# EAGLE schematic touch_glove_bullshit (EAGLE 7.7.0)
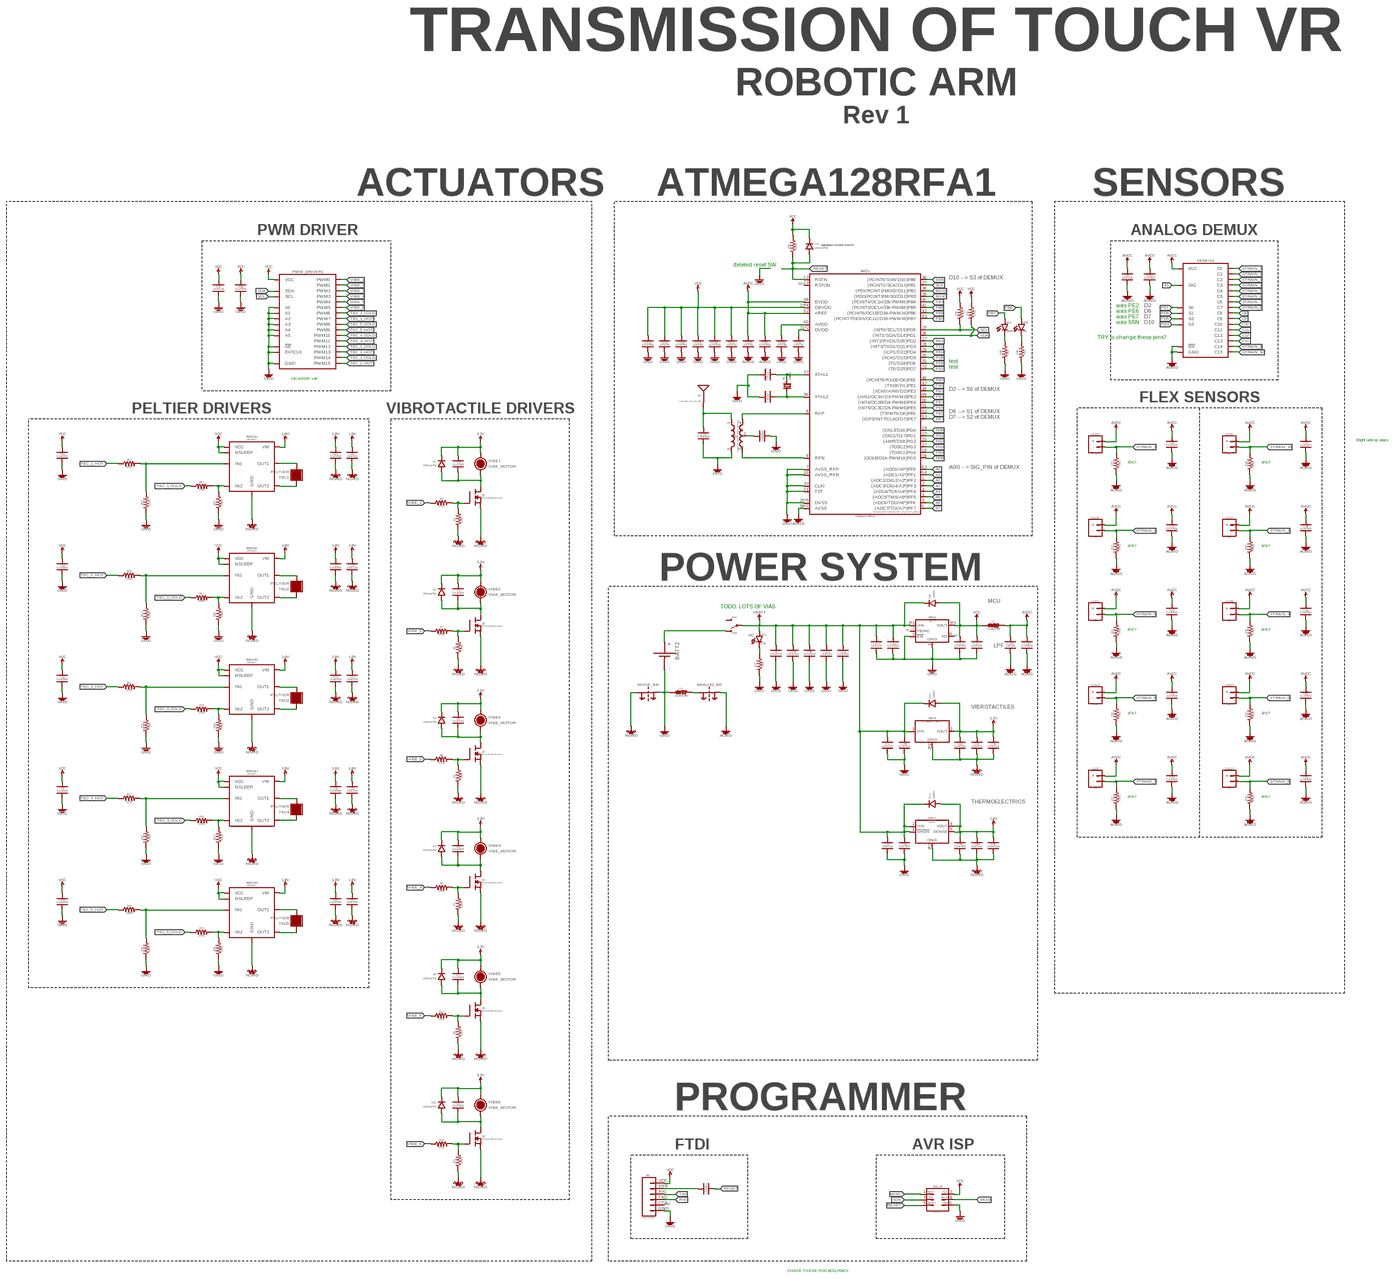
[diagram p0: schematic, sheet 1, overview]
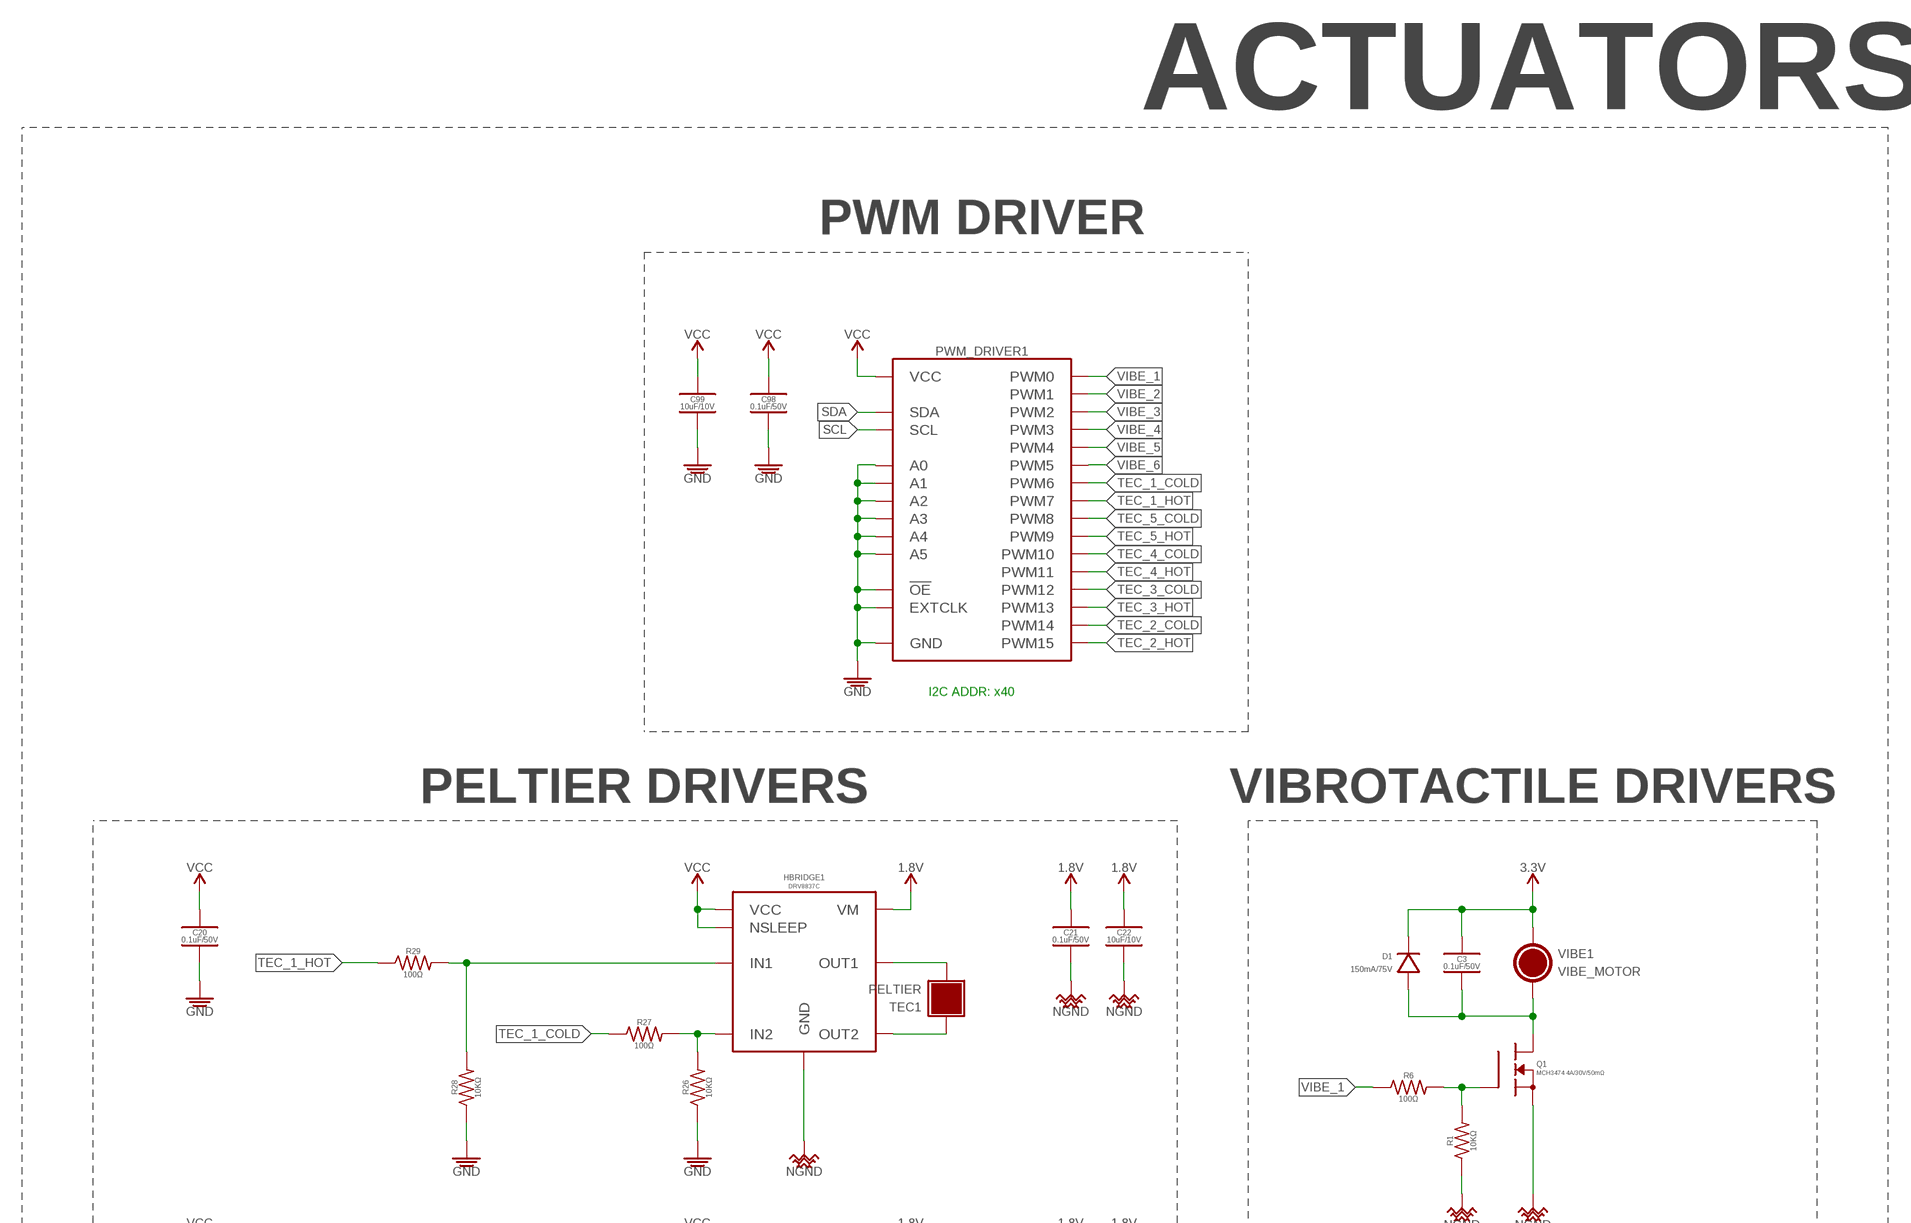
[diagram p1: schematic, sheet 1, part 1 of 4]
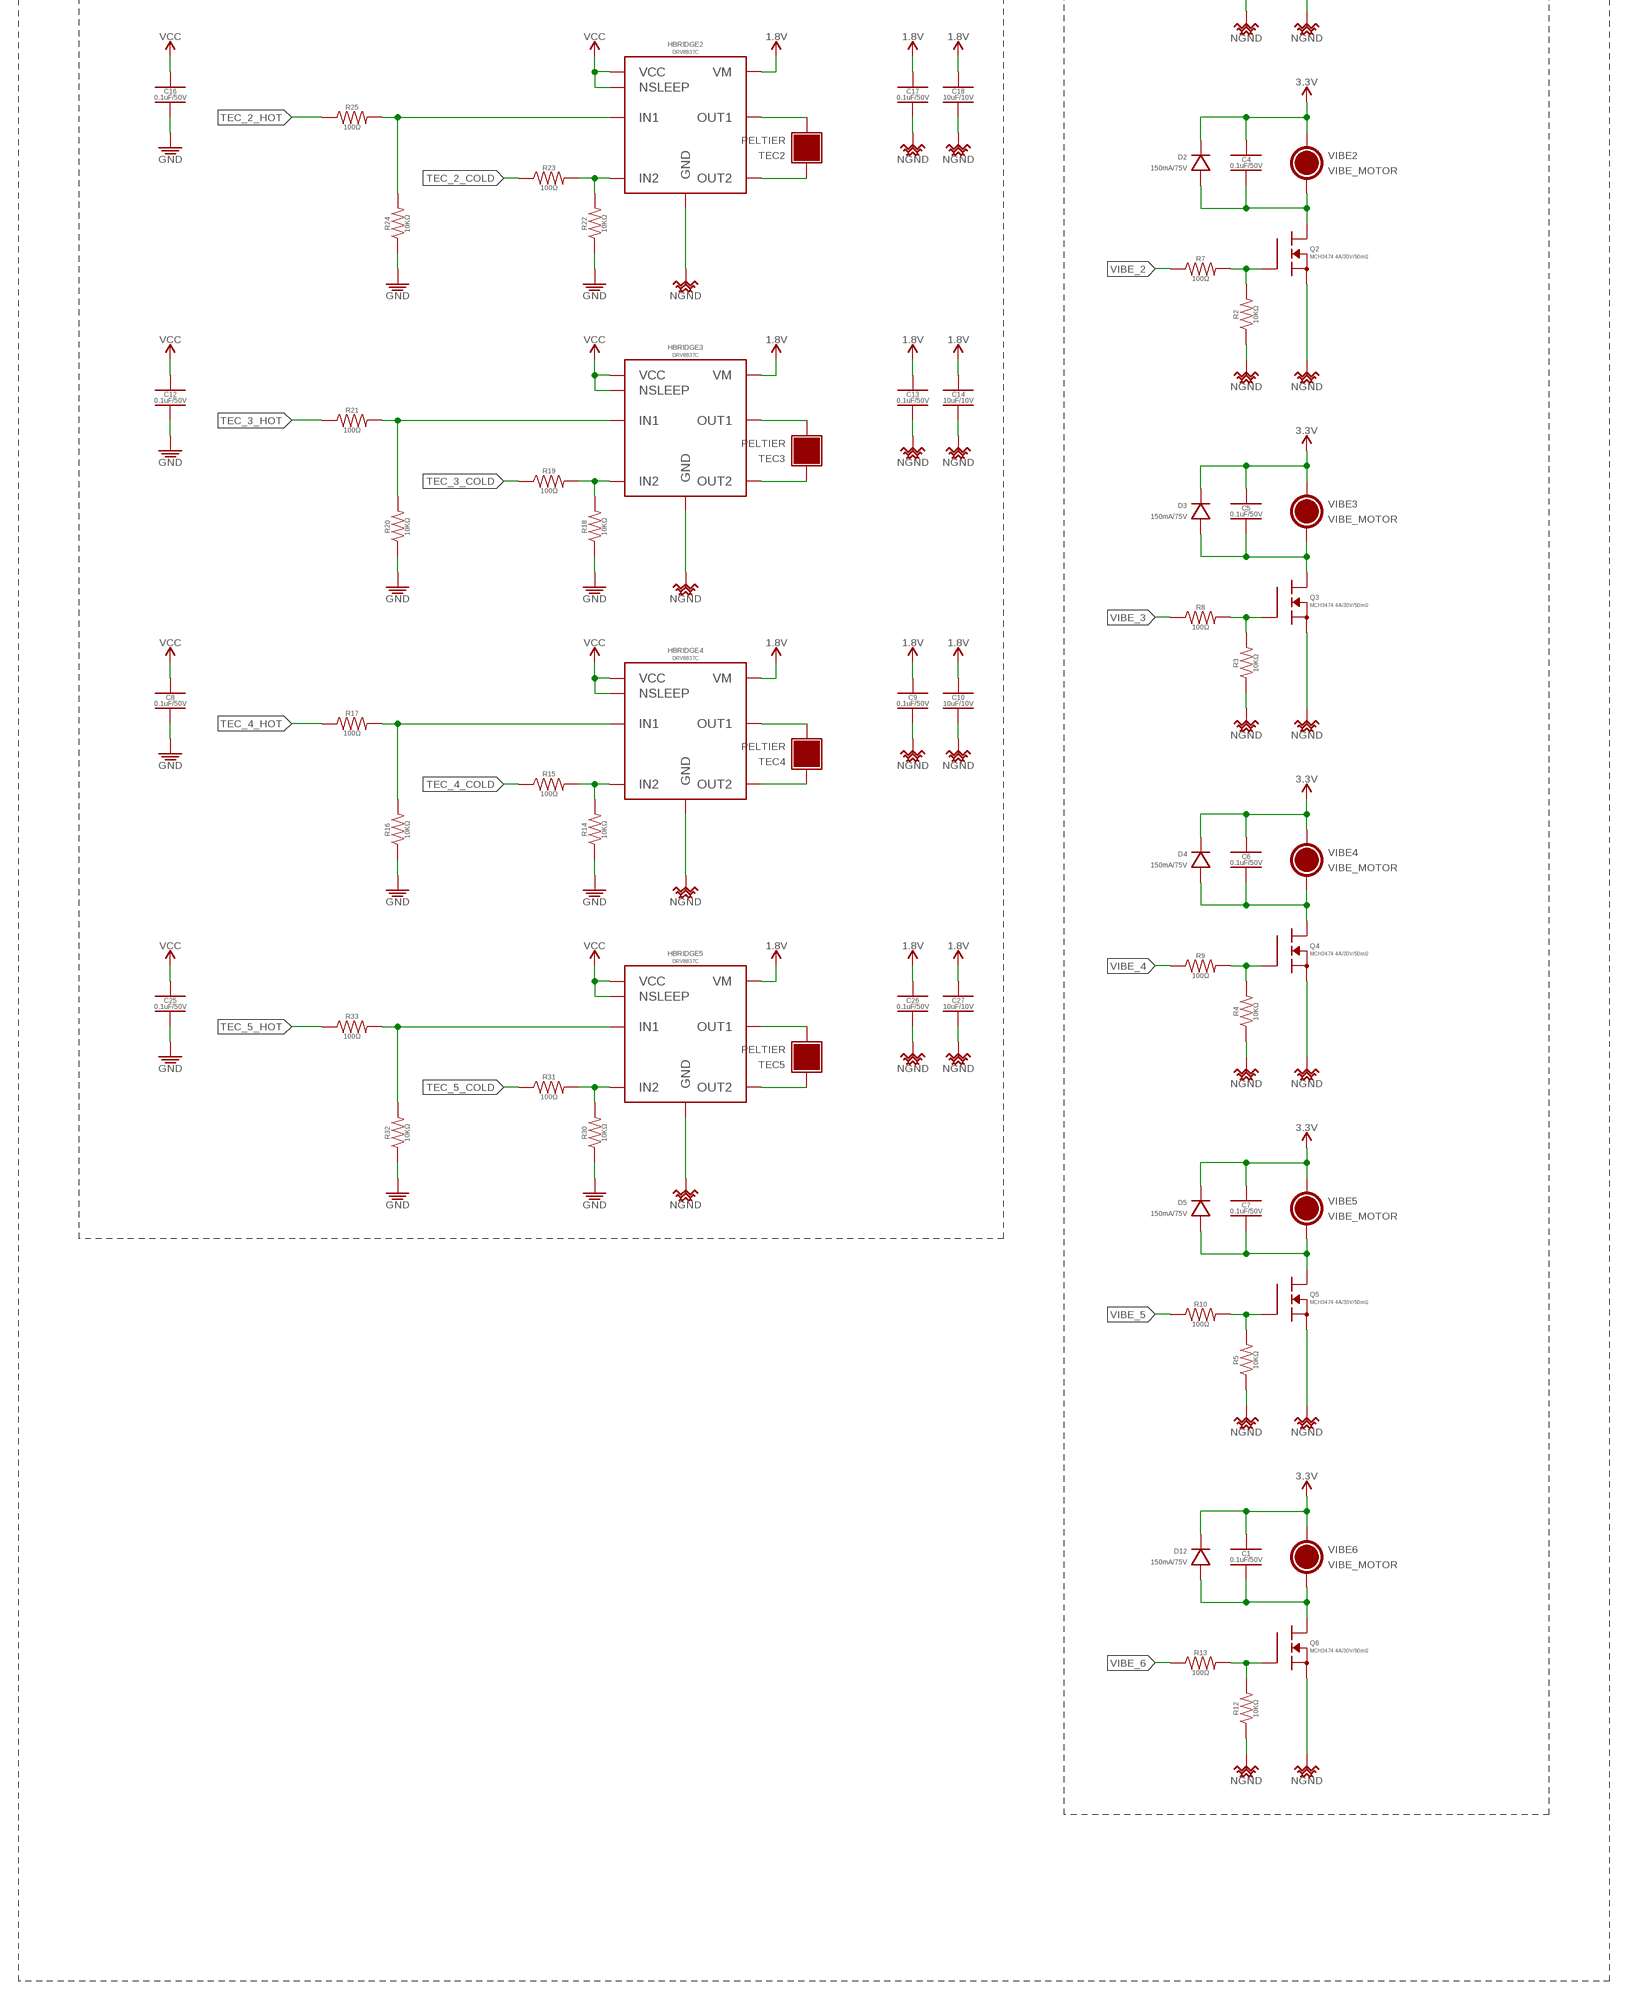
[diagram p2: schematic, sheet 1, part 2 of 4]
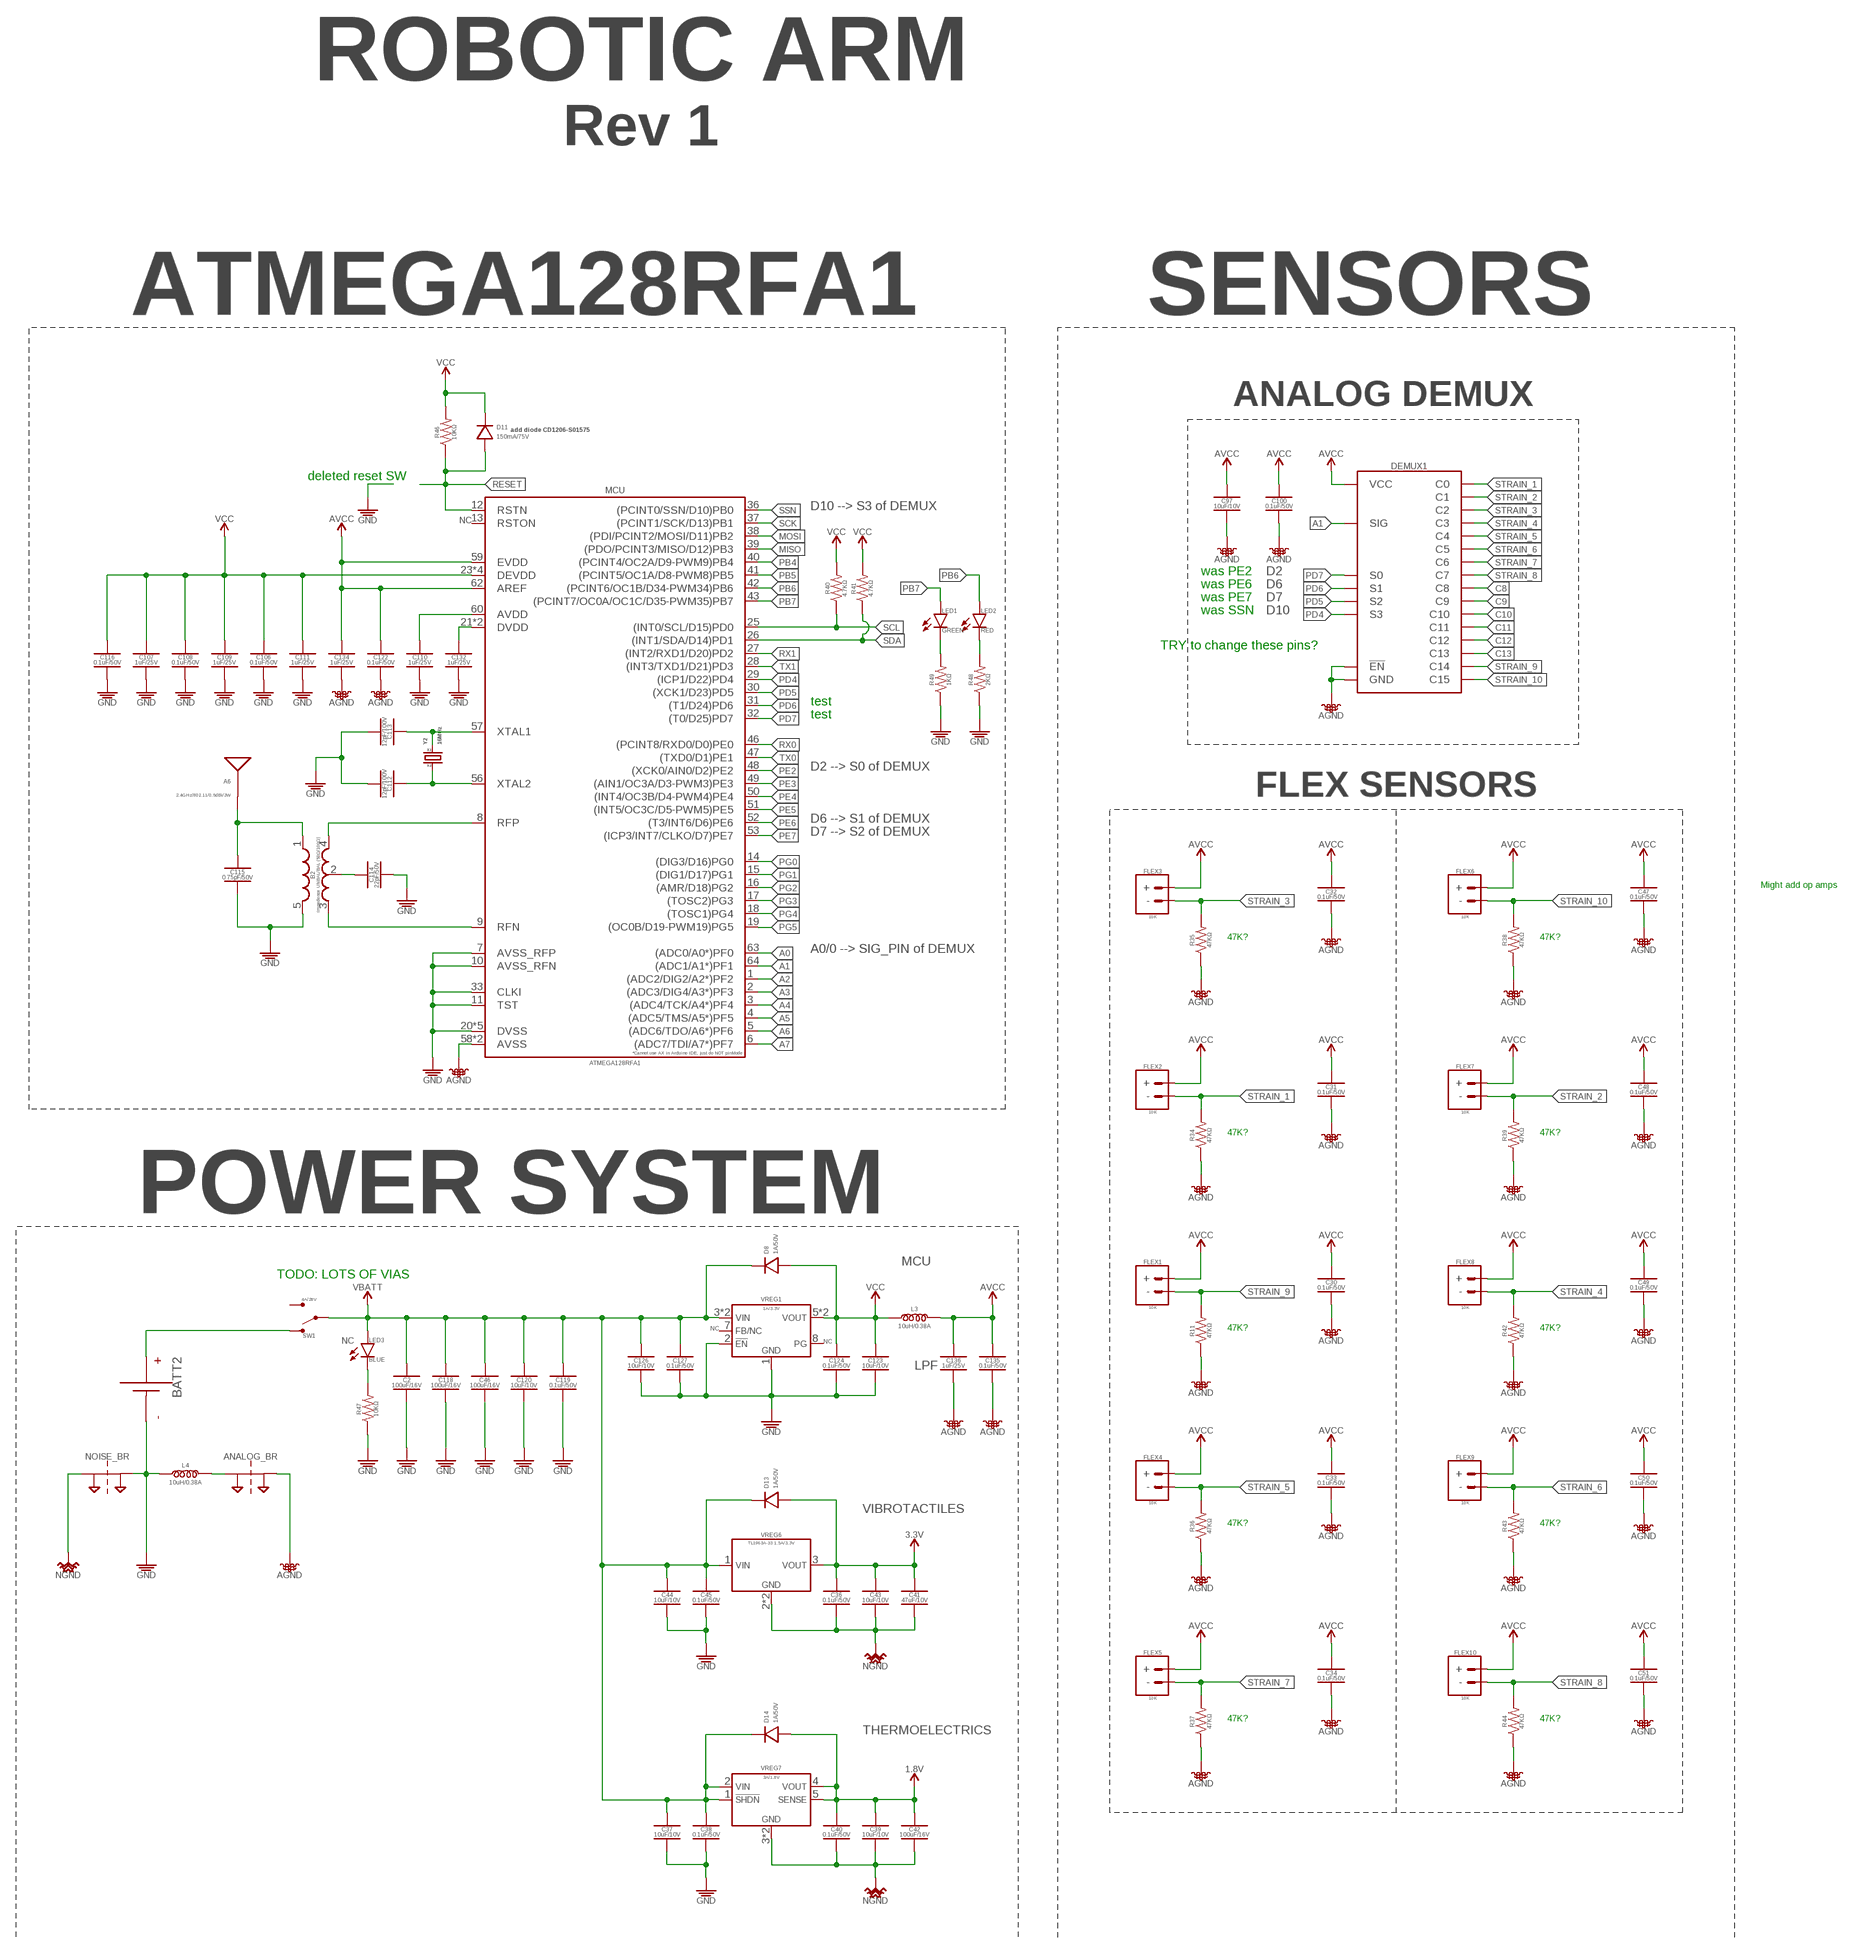
[diagram p3: schematic, sheet 1, part 3 of 4]
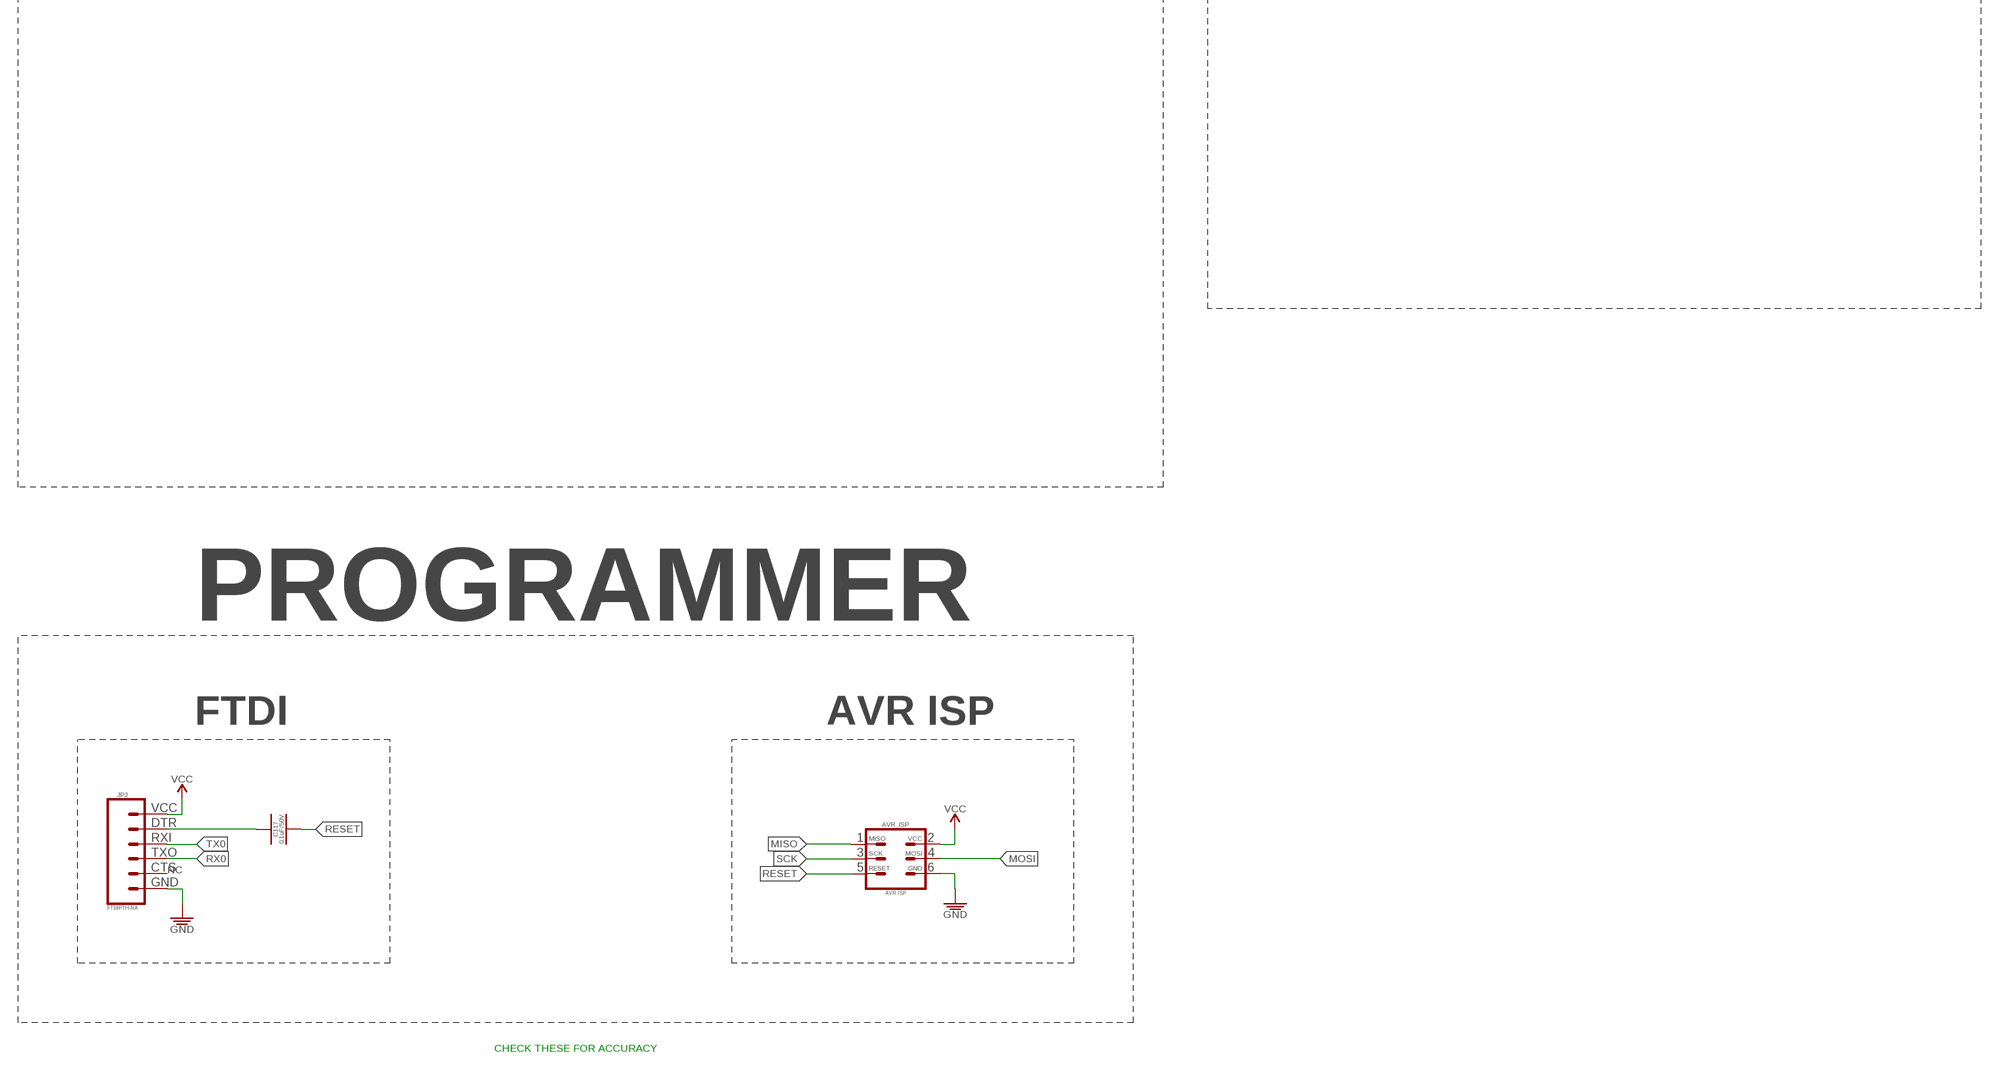
[diagram p4: schematic, sheet 1, part 4 of 4]

## Parts
A6  2.4GHz/802.11/0.5dBi/3W  ANTENNA_SMD-CHIP_2.4GHZ-0.5DBI-3W  [ANTENNA-CHIP5]
ANALOG_BR  2PT_GND_TIE  [2PT_GND_TIE]
AVR_ISP  AVR ISP  AVR_SPI_PRG_6NS  [2X3-NS]
B2  Impedence UNBAL/BAL (50Ω/100Ω)  BALUN_SMD-0805_UNBAL/BAL-50/100  [0805_BALUN]
BATT2  BATTERYPTH_HOLES  [DUAL_PTH_PADS]
C1  0.1uF/50V  0.1UF_SMD-0402_50V-10%  [_CER_SMD_0402]
C2  100uF/16V  100UF_CER_SMD-1210_16V-20%  [_CER_SMD-1210]
C3  0.1uF/50V  0.1UF_SMD-0402_50V-10%  [_CER_SMD_0402]
C4  0.1uF/50V  0.1UF_SMD-0402_50V-10%  [_CER_SMD_0402]
C5  0.1uF/50V  0.1UF_SMD-0402_50V-10%  [_CER_SMD_0402]
C6  0.1uF/50V  0.1UF_SMD-0402_50V-10%  [_CER_SMD_0402]
C7  0.1uF/50V  0.1UF_SMD-0402_50V-10%  [_CER_SMD_0402]
C8  0.1uF/50V  0.1UF_SMD-0402_50V-10%  [_CER_SMD_0402]
C9  0.1uF/50V  0.1UF_SMD-0402_50V-10%  [_CER_SMD_0402]
C10  10uF/10V  10UF_CER_SMD-0402_10V-20%  [_CER_SMD_0402]
C12  0.1uF/50V  0.1UF_SMD-0402_50V-10%  [_CER_SMD_0402]
C13  0.1uF/50V  0.1UF_SMD-0402_50V-10%  [_CER_SMD_0402]
C14  10uF/10V  10UF_CER_SMD-0402_10V-20%  [_CER_SMD_0402]
C16  0.1uF/50V  0.1UF_SMD-0402_50V-10%  [_CER_SMD_0402]
C17  0.1uF/50V  0.1UF_SMD-0402_50V-10%  [_CER_SMD_0402]
C18  10uF/10V  10UF_CER_SMD-0402_10V-20%  [_CER_SMD_0402]
C20  0.1uF/50V  0.1UF_SMD-0402_50V-10%  [_CER_SMD_0402]
C21  0.1uF/50V  0.1UF_SMD-0402_50V-10%  [_CER_SMD_0402]
C22  10uF/10V  10UF_CER_SMD-0402_10V-20%  [_CER_SMD_0402]
C25  0.1uF/50V  0.1UF_SMD-0402_50V-10%  [_CER_SMD_0402]
C26  0.1uF/50V  0.1UF_SMD-0402_50V-10%  [_CER_SMD_0402]
C27  10uF/10V  10UF_CER_SMD-0402_10V-20%  [_CER_SMD_0402]
C30  0.1uF/50V  0.1UF_SMD-0402_50V-10%  [_CER_SMD_0402]
C31  0.1uF/50V  0.1UF_SMD-0402_50V-10%  [_CER_SMD_0402]
C32  0.1uF/50V  0.1UF_SMD-0402_50V-10%  [_CER_SMD_0402]
C33  0.1uF/50V  0.1UF_SMD-0402_50V-10%  [_CER_SMD_0402]
C34  0.1uF/50V  0.1UF_SMD-0402_50V-10%  [_CER_SMD_0402]
C36  0.1uF/50V  0.1UF_SMD-0402_50V-10%  [_CER_SMD_0402]
C37  10uF/10V  10UF_CER_SMD-0402_10V-20%  [_CER_SMD_0402]
C38  0.1uF/50V  0.1UF_SMD-0402_50V-10%  [_CER_SMD_0402]
C39  10uF/10V  10UF_CER_SMD-0402_10V-20%  [_CER_SMD_0402]
C40  0.1uF/50V  0.1UF_SMD-0402_50V-10%  [_CER_SMD_0402]
C41  47uF/10V  47UF_CER_SMD-0805_10V-20%  [_CER_SMD-805]
C42  100uF/16V  100UF_CER_SMD-1210_16V-20%  [_CER_SMD-1210]
C43  10uF/10V  10UF_CER_SMD-0402_10V-20%  [_CER_SMD_0402]
C44  10uF/10V  10UF_CER_SMD-0402_10V-20%  [_CER_SMD_0402]
C45  0.1uF/50V  0.1UF_SMD-0402_50V-10%  [_CER_SMD_0402]
C46  100uF/16V  100UF_CER_SMD-1210_16V-20%  [_CER_SMD-1210]
C47  0.1uF/50V  0.1UF_SMD-0402_50V-10%  [_CER_SMD_0402]
C48  0.1uF/50V  0.1UF_SMD-0402_50V-10%  [_CER_SMD_0402]
C49  0.1uF/50V  0.1UF_SMD-0402_50V-10%  [_CER_SMD_0402]
C50  0.1uF/50V  0.1UF_SMD-0402_50V-10%  [_CER_SMD_0402]
C51  0.1uF/50V  0.1UF_SMD-0402_50V-10%  [_CER_SMD_0402]
C97  10uF/10V  10UF_CER_SMD-0402_10V-20%  [_CER_SMD_0402]
C98  0.1uF/50V  0.1UF_SMD-0402_50V-10%  [_CER_SMD_0402]
C99  10uF/10V  10UF_CER_SMD-0402_10V-20%  [_CER_SMD_0402]
C100  0.1uF/50V  0.1UF_SMD-0402_50V-10%  [_CER_SMD_0402]
C106  0.1uF/50V  0.1UF_SMD-0402_50V-10%  [_CER_SMD_0402]
C107  1uF/25V  1UF_CER_SMD-0402_25V-10%  [_CER_SMD_0402]
C108  0.1uF/50V  0.1UF_SMD-0402_50V-10%  [_CER_SMD_0402]
C109  1uF/25V  1UF_CER_SMD-0402_25V-10%  [_CER_SMD_0402]
C110  1uF/25V  1UF_CER_SMD-0402_25V-10%  [_CER_SMD_0402]
C111  1uF/25V  1UF_CER_SMD-0402_25V-10%  [_CER_SMD_0402]
C112  12pF/100V  12PF_SMD-0402_100V-5%  [_CER_SMD_0402]
C113  12pF/100V  12PF_SMD-0402_100V-5%  [_CER_SMD_0402]
C114  22pF/50V  22PF_SMD-0402_100V-5%  [_CER_SMD_0402]
C115  0.75pF/50V  0.75PF_SMD-0402_50V-33%  [_CER_SMD_0402]
C116  0.1uF/50V  0.1UF_SMD-0402_50V-10%  [_CER_SMD_0402]
C117  0.1uF/50V  0.1UF_SMD-0402_50V-10%  [_CER_SMD_0402]
C118  100uF/16V  100UF_CER_SMD-1210_16V-20%  [_CER_SMD-1210]
C119  0.1uF/50V  0.1UF_SMD-0402_50V-10%  [_CER_SMD_0402]
C120  10uF/10V  10UF_CER_SMD-0402_10V-20%  [_CER_SMD_0402]
C122  0.1uF/50V  0.1UF_SMD-0402_50V-10%  [_CER_SMD_0402]
C123  10uF/10V  10UF_CER_SMD-0402_10V-20%  [_CER_SMD_0402]
C124  0.1uF/50V  0.1UF_SMD-0402_50V-10%  [_CER_SMD_0402]
C126  10uF/10V  10UF_CER_SMD-0402_10V-20%  [_CER_SMD_0402]
C127  0.1uF/50V  0.1UF_SMD-0402_50V-10%  [_CER_SMD_0402]
C132  1uF/25V  1UF_CER_SMD-0402_25V-10%  [_CER_SMD_0402]
C134  1uF/25V  1UF_CER_SMD-0402_25V-10%  [_CER_SMD_0402]
C135  0.1uF/50V  0.1UF_SMD-0402_50V-10%  [_CER_SMD_0402]
C136  1uF/25V  1UF_CER_SMD-0402_25V-10%  [_CER_SMD_0402]
D1  150mA/75V  DIODE_GENERAL-PURPOSE_SMD-0402_GP_120MA-75V  [SOD-923F/0402]
D2  150mA/75V  DIODE_GENERAL-PURPOSE_SMD-0402_GP_120MA-75V  [SOD-923F/0402]
D3  150mA/75V  DIODE_GENERAL-PURPOSE_SMD-0402_GP_120MA-75V  [SOD-923F/0402]
D4  150mA/75V  DIODE_GENERAL-PURPOSE_SMD-0402_GP_120MA-75V  [SOD-923F/0402]
D5  150mA/75V  DIODE_GENERAL-PURPOSE_SMD-0402_GP_120MA-75V  [SOD-923F/0402]
D8  1A/50V  DIODE_GENERAL-PURPOSE_SMD_GP_1A-50V  [SOD123F]
D11  150mA/75V  DIODE_GENERAL-PURPOSE_SMD-0402_GP_120MA-75V  [SOD-923F/0402]
D12  150mA/75V  DIODE_GENERAL-PURPOSE_SMD-0402_GP_120MA-75V  [SOD-923F/0402]
D13  1A/50V  DIODE_GENERAL-PURPOSE_SMD_GP_1A-50V  [SOD123F]
D14  1A/50V  DIODE_GENERAL-PURPOSE_SMD_GP_1A-50V  [SOD123F]
DEMUX1  CH16_MUX-DEMUX  CD74HC4067-SM96_16:1_MUX-DEMUX  [SSOP-24]
FLEX1  10K  FLEX-SENSOR10K_2.2IN  [CONNECTOR_FSR]
FLEX2  10K  FLEX-SENSOR10K_2.2IN  [CONNECTOR_FSR]
FLEX3  10K  FLEX-SENSOR10K_2.2IN  [CONNECTOR_FSR]
FLEX4  10K  FLEX-SENSOR10K_2.2IN  [CONNECTOR_FSR]
FLEX5  10K  FLEX-SENSOR10K_2.2IN  [CONNECTOR_FSR]
FLEX6  10K  FLEX-SENSOR10K_2.2IN  [CONNECTOR_FSR]
FLEX7  10K  FLEX-SENSOR10K_2.2IN  [CONNECTOR_FSR]
FLEX8  10K  FLEX-SENSOR10K_2.2IN  [CONNECTOR_FSR]
FLEX9  10K  FLEX-SENSOR10K_2.2IN  [CONNECTOR_FSR]
FLEX10  10K  FLEX-SENSOR10K_2.2IN  [CONNECTOR_FSR]
HBRIDGE1  DRV8837C  DRV883X_H-BRIDGE_DRV8837C_1A  [WSON-8-PPAD]
HBRIDGE2  DRV8837C  DRV883X_H-BRIDGE_DRV8837C_1A  [WSON-8-PPAD]
HBRIDGE3  DRV8837C  DRV883X_H-BRIDGE_DRV8837C_1A  [WSON-8-PPAD]
HBRIDGE4  DRV8837C  DRV883X_H-BRIDGE_DRV8837C_1A  [WSON-8-PPAD]
HBRIDGE5  DRV8837C  DRV883X_H-BRIDGE_DRV8837C_1A  [WSON-8-PPAD]
JP2  FTDIPTH-RA  [FTDI_BASIC-6PIN-MALE-RA]
L3  10uH/0.38A  10UH_SMD-0603_0.38A-0.468OHM-10%  [_SMD-0603]
L4  10uH/0.38A  10UH_SMD-0603_0.38A-0.468OHM-10%  [_SMD-0603]
LED1  GREEN  LED_SMD-0402_DISCRETE_GREEN  [LED_SMD-0402]
LED2  RED  LED_SMD-0402_DISCRETE_RED  [LED_SMD-0402]
LED3  BLUE  LED_SMD-0402_DISCRETE_BLUE  [LED_SMD-0402]
MCU  ATMEGA128RFA1  ATMEGA128RFA1_VFQFN-64_EXPOSED-PAD  [VFQFN-64]
NOISE_BR  2PT_GND_TIE  [2PT_GND_TIE]
PWM_DRIVER1  PCA9685  PCA9685_16-CH_12-BIT_PWM-DRIVER  [TSSOP-28]
Q1  MCH3474 4A/30V/50mΩ  POWER_NCHAN_MCH3474  [SC-70FL/MCPH3]
Q2  MCH3474 4A/30V/50mΩ  POWER_NCHAN_MCH3474  [SC-70FL/MCPH3]
Q3  MCH3474 4A/30V/50mΩ  POWER_NCHAN_MCH3474  [SC-70FL/MCPH3]
Q4  MCH3474 4A/30V/50mΩ  POWER_NCHAN_MCH3474  [SC-70FL/MCPH3]
Q5  MCH3474 4A/30V/50mΩ  POWER_NCHAN_MCH3474  [SC-70FL/MCPH3]
Q6  MCH3474 4A/30V/50mΩ  POWER_NCHAN_MCH3474  [SC-70FL/MCPH3]
R1  10KΩ  10KΩ_SMD-0402_1/16W-5%  [RESISTOR_SMD-0402]
R2  10KΩ  10KΩ_SMD-0402_1/16W-5%  [RESISTOR_SMD-0402]
R3  10KΩ  10KΩ_SMD-0402_1/16W-5%  [RESISTOR_SMD-0402]
R4  10KΩ  10KΩ_SMD-0402_1/16W-5%  [RESISTOR_SMD-0402]
R5  10KΩ  10KΩ_SMD-0402_1/16W-5%  [RESISTOR_SMD-0402]
R6  100Ω  100Ω_SMD-0402_1/16W-5%  [RESISTOR_SMD-0402]
R7  100Ω  100Ω_SMD-0402_1/16W-5%  [RESISTOR_SMD-0402]
R8  100Ω  100Ω_SMD-0402_1/16W-5%  [RESISTOR_SMD-0402]
R9  100Ω  100Ω_SMD-0402_1/16W-5%  [RESISTOR_SMD-0402]
R10  100Ω  100Ω_SMD-0402_1/16W-5%  [RESISTOR_SMD-0402]
R11  47KΩ  47KΩ_SMD-0402_1/16W-5%  [RESISTOR_SMD-0402]
R12  10KΩ  10KΩ_SMD-0402_1/16W-5%  [RESISTOR_SMD-0402]
R13  100Ω  100Ω_SMD-0402_1/16W-5%  [RESISTOR_SMD-0402]
R14  10KΩ  10KΩ_SMD-0402_1/16W-5%  [RESISTOR_SMD-0402]
R15  100Ω  100Ω_SMD-0402_1/16W-5%  [RESISTOR_SMD-0402]
R16  10KΩ  10KΩ_SMD-0402_1/16W-5%  [RESISTOR_SMD-0402]
R17  100Ω  100Ω_SMD-0402_1/16W-5%  [RESISTOR_SMD-0402]
R18  10KΩ  10KΩ_SMD-0402_1/16W-5%  [RESISTOR_SMD-0402]
R19  100Ω  100Ω_SMD-0402_1/16W-5%  [RESISTOR_SMD-0402]
R20  10KΩ  10KΩ_SMD-0402_1/16W-5%  [RESISTOR_SMD-0402]
R21  100Ω  100Ω_SMD-0402_1/16W-5%  [RESISTOR_SMD-0402]
R22  10KΩ  10KΩ_SMD-0402_1/16W-5%  [RESISTOR_SMD-0402]
R23  100Ω  100Ω_SMD-0402_1/16W-5%  [RESISTOR_SMD-0402]
R24  10KΩ  10KΩ_SMD-0402_1/16W-5%  [RESISTOR_SMD-0402]
R25  100Ω  100Ω_SMD-0402_1/16W-5%  [RESISTOR_SMD-0402]
R26  10KΩ  10KΩ_SMD-0402_1/16W-5%  [RESISTOR_SMD-0402]
R27  100Ω  100Ω_SMD-0402_1/16W-5%  [RESISTOR_SMD-0402]
R28  10KΩ  10KΩ_SMD-0402_1/16W-5%  [RESISTOR_SMD-0402]
R29  100Ω  100Ω_SMD-0402_1/16W-5%  [RESISTOR_SMD-0402]
R30  10KΩ  10KΩ_SMD-0402_1/16W-5%  [RESISTOR_SMD-0402]
R31  100Ω  100Ω_SMD-0402_1/16W-5%  [RESISTOR_SMD-0402]
R32  10KΩ  10KΩ_SMD-0402_1/16W-5%  [RESISTOR_SMD-0402]
R33  100Ω  100Ω_SMD-0402_1/16W-5%  [RESISTOR_SMD-0402]
R34  47KΩ  47KΩ_SMD-0402_1/16W-5%  [RESISTOR_SMD-0402]
R35  47KΩ  47KΩ_SMD-0402_1/16W-5%  [RESISTOR_SMD-0402]
R36  47KΩ  47KΩ_SMD-0402_1/16W-5%  [RESISTOR_SMD-0402]
R37  47KΩ  47KΩ_SMD-0402_1/16W-5%  [RESISTOR_SMD-0402]
R38  47KΩ  47KΩ_SMD-0402_1/16W-5%  [RESISTOR_SMD-0402]
R39  47KΩ  47KΩ_SMD-0402_1/16W-5%  [RESISTOR_SMD-0402]
R40  4.7KΩ  4.7KΩ_SMD-0402_1/16W-5%  [RESISTOR_SMD-0402]
R41  4.7KΩ  4.7KΩ_SMD-0402_1/16W-5%  [RESISTOR_SMD-0402]
R42  47KΩ  47KΩ_SMD-0402_1/16W-5%  [RESISTOR_SMD-0402]
R43  47KΩ  47KΩ_SMD-0402_1/16W-5%  [RESISTOR_SMD-0402]
R44  47KΩ  47KΩ_SMD-0402_1/16W-5%  [RESISTOR_SMD-0402]
R46  10KΩ  10KΩ_SMD-0402_1/16W-5%  [RESISTOR_SMD-0402]
R47  10KΩ  10KΩ_SMD-0402_1/16W-5%  [RESISTOR_SMD-0402]
R48  2KΩ  2KΩ_SMD-0402_1/16W-5%  [RESISTOR_SMD-0402]
R49  1KΩ  1KΩ_SMD-0402_1/16W-5%  [RESISTOR_SMD-0402]
SW1  4A/28V  SWITCH_SPDT_RA_PTH_4A-28V_L12.7-W9.5  [SW_SLIDE_RA_SPDT_4A-28V_L12.7-W9.5]
TEC1  PELTIER  PELTIER-TECNL1025T_1.8A-4.4V_L10.7-W8.8-H2  [CONNECTOR_PELTIER]
TEC2  PELTIER  PELTIER-TECNL1025T_1.8A-4.4V_L10.7-W8.8-H2  [CONNECTOR_PELTIER]
TEC3  PELTIER  PELTIER-TECNL1025T_1.8A-4.4V_L10.7-W8.8-H2  [CONNECTOR_PELTIER]
TEC4  PELTIER  PELTIER-TECNL1025T_1.8A-4.4V_L10.7-W8.8-H2  [CONNECTOR_PELTIER]
TEC5  PELTIER  PELTIER-TECNL1025T_1.8A-4.4V_L10.7-W8.8-H2  [CONNECTOR_PELTIER]
VIBE1  VIBE_MOTOR  VIBE_MOTOR_100MA/3V  [CONNECTOR_VIBE-MOTOR]
VIBE2  VIBE_MOTOR  VIBE_MOTOR_100MA/3V  [CONNECTOR_VIBE-MOTOR]
VIBE3  VIBE_MOTOR  VIBE_MOTOR_100MA/3V  [CONNECTOR_VIBE-MOTOR]
VIBE4  VIBE_MOTOR  VIBE_MOTOR_100MA/3V  [CONNECTOR_VIBE-MOTOR]
VIBE5  VIBE_MOTOR  VIBE_MOTOR_100MA/3V  [CONNECTOR_VIBE-MOTOR]
VIBE6  VIBE_MOTOR  VIBE_MOTOR_100MA/3V  [CONNECTOR_VIBE-MOTOR]
VREG1  1A/3.3V  VREG_TPS76833_ULDO_FAST-TRANSIENT_1A-3.3VTPS76833QDR_1A-3.3V  [SOIC-8_W3.9MM]
VREG6  TL1963A-33 1.5A/3.3V  VREG_LINEAR_FIXED_TL1963A-33_LDO_1.5A-3.3V  [SOT223-4]
VREG7  3A/1.8V  VREG_LT1764EQ_ULDO_FAST-TRANSIENT_LT1764EQ-1.8_3A-1.8V  [DDPAK-5]
Y2  16MHz  CRYSTAL_ABM3B_16MHZ_18PF  [CRYSTAL-SMD-5X3]

## Nets
1.8V: C9.1 C10.1 C13.1 C14.1 C17.1 C18.1 C21.1 C22.1 C26.1 C27.1 C39.1 C40.1 C42.1 D14.A HBRIDGE1.1(VM) HBRIDGE2.1(VM) HBRIDGE3.1(VM) HBRIDGE4.1(VM) HBRIDGE5.1(VM) VREG7.4(VOUT) VREG7.5(SENSE)
3.3V: C1.1 C3.1 C4.1 C5.1 C6.1 C7.1 C36.1 C41.1 C43.1 D1.K D2.K D3.K D4.K D5.K D12.K D13.A VIBE1.1(+) VIBE2.1(+) VIBE3.1(+) VIBE4.1(+) VIBE5.1(+) VIBE6.1(+) VREG6.3(VO)
A0: MCU.63((ADC0/A0*)PF0)
A1: DEMUX1.1(SIG) MCU.64((ADC1/A1*)PF1)
A2: MCU.1((ADC2/DIG2/A2*)PF2)
A3: MCU.2((ADC3/DIG4/A3*)PF3)
A4: MCU.3((ADC4/TCK/A4*)PF4)
A5: MCU.4((ADC5/TMS/A5*)PF5)
A6: MCU.5((ADC6/TDO/A6*)PF6)
A7: MCU.6((ADC7/TDI/A7*)PF7)
AGND: ANALOG_BR.P$2 C30.2 C31.2 C32.2 C33.2 C34.2 C47.2 C48.2 C49.2 C50.2 C51.2 C97.2 C100.2 C122.2 C134.2 C135.2 C136.2 DEMUX1.12(GND) DEMUX1.15(!EN) MCU.58(AVSS) MCU.61(AVSS) R11.1 R34.1 R35.1 R36.1 R37.1 R38.1 R39.1 R42.1 R43.1 R44.1
AVCC: C30.1 C31.1 C32.1 C33.1 C34.1 C47.1 C48.1 C49.1 C50.1 C51.1 C97.1 C100.1 C122.1 C134.1 C135.1 C136.1 DEMUX1.24(VCC) FLEX1.+ FLEX2.+ FLEX3.+ FLEX4.+ FLEX5.+ FLEX6.+ FLEX7.+ FLEX8.+ FLEX9.+ FLEX10.+ L3.2 MCU.59(EVDD) MCU.62(AREF)
BATT_+: BATT2.+(P) SW1.P
C8: DEMUX1.23(C8)
C9: DEMUX1.22(C9)
C10: DEMUX1.21(C10)
C11: DEMUX1.20(C11)
C12: DEMUX1.19(C12)
C13: DEMUX1.18(C13)
GND: AVR_ISP.6 B2.5(GND) BATT2.-(N) C2.2 C8.2 C12.2 C16.2 C20.2 C25.2 C37.2 C38.2 C44.2 C45.2 C46.2 C98.2 C99.2 C106.2 C107.2 C108.2 C109.2 C110.2 C111.2 C112.2 C113.2 C114.2 C115.2 C116.2 C118.2 C119.2 C120.2 C123.2 C124.2 C126.2 C127.2 C132.2 JP2.GND L4.1 MCU.7(AVSS_RFP) MCU.10(AVSS_RFN) MCU.11(TST) MCU.20(DVSS) MCU.24(DVSS) MCU.33(CLKI) MCU.35(DVSS) MCU.45(DVSS) MCU.55(DVSS) NOISE_BR.P$2 PWM_DRIVER1.1(A0) PWM_DRIVER1.2(A1) PWM_DRIVER1.3(A2) PWM_DRIVER1.4(A3) PWM_DRIVER1.5(A4) PWM_DRIVER1.14(GND) PWM_DRIVER1.23(!OE) PWM_DRIVER1.24(A5) PWM_DRIVER1.25(EXTCLK) R14.1 R16.1 R18.1 R20.1 R22.1 R24.1 R26.1 R28.1 R30.1 R32.1 R47.1 R48.1 R49.1 VREG1.1(GND) VREG1.2(!EN)
MISO: AVR_ISP.1 MCU.39((PDO/PCINT3/MISO/D12)PB3)
MOSI: AVR_ISP.4 MCU.38((PDI/PCINT2/MOSI/D11)PB2)
N$1: HBRIDGE5.3(OUT2) TEC5.HOT
N$2: C6.2 D4.A Q4.3(D) VIBE4.2(-)
N$3: C7.2 D5.A Q5.3(D) VIBE5.2(-)
N$4: C5.2 D3.A Q3.3(D) VIBE3.2(-)
N$5: HBRIDGE5.2(OUT1) TEC5.COLD
N$6: HBRIDGE4.2(OUT1) TEC4.COLD
N$7: Q2.1(G) R2.2 R7.2
N$8: HBRIDGE4.5(IN2) R14.2 R15.2
N$9: Q3.1(G) R3.2 R8.2
N$10: HBRIDGE4.6(IN1) R16.2 R17.2
N$11: HBRIDGE4.3(OUT2) TEC4.HOT
N$12: HBRIDGE3.3(OUT2) TEC3.HOT
N$13: HBRIDGE3.5(IN2) R18.2 R19.2
N$14: HBRIDGE3.6(IN1) R20.2 R21.2
N$15: C4.2 D2.A Q2.3(D) VIBE2.2(-)
N$16: HBRIDGE3.2(OUT1) TEC3.COLD
N$17: C3.2 D1.A Q1.3(D) VIBE1.2(-)
N$18: HBRIDGE2.3(OUT2) TEC2.HOT
N$19: HBRIDGE2.5(IN2) R22.2 R23.2
N$20: HBRIDGE2.6(IN1) R24.2 R25.2
N$21: Q4.1(G) R4.2 R9.2
N$22: Q5.1(G) R5.2 R10.2
N$23: HBRIDGE2.2(OUT1) TEC2.COLD
N$24: HBRIDGE1.3(OUT2) TEC1.HOT
N$25: HBRIDGE1.5(IN2) R26.2 R27.2
N$26: HBRIDGE1.6(IN1) R28.2 R29.2
N$27: HBRIDGE1.2(OUT1) TEC1.COLD
N$28: Q1.1(G) R1.2 R6.2
N$29: HBRIDGE5.5(IN2) R30.2 R31.2
N$30: C1.2 D12.A Q6.3(D) VIBE6.2(-)
N$31: HBRIDGE5.6(IN1) R32.2 R33.2
N$32: Q6.1(G) R12.2 R13.2
N$44: C113.1 MCU.57(XTAL1) Y2.3
N$45: B2.3(OUT2) MCU.9(RFN)
N$46: B2.4(OUT1) MCU.8(RFP)
N$47: B2.2(GND) C114.1
N$48: C112.1 MCU.56(XTAL2) Y2.1
N$49: A6.FEED(SIGNAL) B2.1(IN) C115.1
N$50: C117.1 JP2.DTR
N$52: ANALOG_BR.P$1 L4.2
N$53: LED3.K R47.2
N$54: LED1.K R49.2
N$55: LED2.K R48.2
N$62: C132.1 MCU.21(DVDD) MCU.22(DVDD)
N$63: C110.1 MCU.60(AVDD)
NGND: C9.2 C10.2 C13.2 C14.2 C17.2 C18.2 C21.2 C22.2 C26.2 C27.2 C36.2 C39.2 C40.2 C41.2 C42.2 C43.2 HBRIDGE1.4(GND) HBRIDGE1.GND HBRIDGE1.P$1(GND) HBRIDGE1.P$2(GND) HBRIDGE2.4(GND) HBRIDGE2.GND HBRIDGE2.P$1(GND) HBRIDGE2.P$2(GND) HBRIDGE3.4(GND) HBRIDGE3.GND HBRIDGE3.P$1(GND) HBRIDGE3.P$2(GND) HBRIDGE4.4(GND) HBRIDGE4.GND HBRIDGE4.P$1(GND) HBRIDGE4.P$2(GND) HBRIDGE5.4(GND) HBRIDGE5.GND HBRIDGE5.P$1(GND) HBRIDGE5.P$2(GND) NOISE_BR.P$1 Q1.2(S) Q2.2(S) Q3.2(S) Q4.2(S) Q5.2(S) Q6.2(S) R1.1 R2.1 R3.1 R4.1 R5.1 R12.1 VREG6.2(GND) VREG6.TAB(GND) VREG7.3(GND) VREG7.TAB(GND)
PB4: MCU.40((PCINT4/OC2A/D9-PWM9)PB4)
PB5: MCU.41((PCINT5/OC1A/D8-PWM8)PB5)
PB6: LED2.A MCU.42((PCINT6/OC1B/D34-PWM34)PB6)
PB7: LED1.A MCU.43((PCINT7/OC0A/OC1C/D35-PWM35)PB7)
PD4: DEMUX1.13(S3) MCU.29((ICP1/D22)PD4)
PD5: DEMUX1.14(S2) MCU.30((XCK1/D23)PD5)
PD6: DEMUX1.11(S1) MCU.31((T1/D24)PD6)
PD7: DEMUX1.10(S0) MCU.32((T0/D25)PD7)
PE2: MCU.48((XCK0/AIN0/D2)PE2)
PE3: MCU.49((AIN1/OC3A/D3-PWM3)PE3)
PE4: MCU.50((INT4/OC3B/D4-PWM4)PE4)
PE5: MCU.51((INT5/OC3C/D5-PWM5)PE5)
PE6: MCU.52((T3/INT6/D6)PE6)
PE7: MCU.53((ICP3/INT7/CLKO/D7)PE7)
PG0: MCU.14((DIG3/D16)PG0)
PG1: MCU.15((DIG1/D17)PG1)
PG2: MCU.16((AMR/D18)PG2)
PG3: MCU.17((TOSC2)PG3)
PG4: MCU.18((TOSC1)PG4)
PG5: MCU.19((OC0B/D19-PWM19)PG5)
RESET: AVR_ISP.5 C117.2 D11.A MCU.12(RSTN) R46.1
RX0: JP2.TXO MCU.46((PCINT8/RXD0/D0)PE0)
RX1: MCU.27((INT2/RXD1/D20)PD2)
SCK: AVR_ISP.3 MCU.37((PCINT1/SCK/D13)PB1)
SCL: MCU.25((INT0/SCL/D15)PD0) PWM_DRIVER1.26(SCL) R40.1
SDA: MCU.26((INT1/SDA/D14)PD1) PWM_DRIVER1.27(SDA) R41.1
SSN: MCU.36((PCINT0/SSN/D10)PB0)
STRAIN_1: DEMUX1.9(C0) FLEX2.- R34.2
STRAIN_2: DEMUX1.8(C1) FLEX7.- R39.2
STRAIN_3: DEMUX1.7(C2) FLEX3.- R35.2
STRAIN_4: DEMUX1.6(C3) FLEX8.- R42.2
STRAIN_5: DEMUX1.5(C4) FLEX4.- R36.2
STRAIN_6: DEMUX1.4(C5) FLEX9.- R43.2
STRAIN_7: DEMUX1.3(C6) FLEX5.- R37.2
STRAIN_8: DEMUX1.2(C7) FLEX10.- R44.2
STRAIN_9: DEMUX1.17(C14) FLEX1.- R11.2
STRAIN_10: DEMUX1.16(C15) FLEX6.- R38.2
TEC_1_COLD: PWM_DRIVER1.12(PWM6) R27.1
TEC_1_HOT: PWM_DRIVER1.13(PWM7) R29.1
TEC_2_COLD: PWM_DRIVER1.21(PWM14) R23.1
TEC_2_HOT: PWM_DRIVER1.22(PWM15) R25.1
TEC_3_COLD: PWM_DRIVER1.19(PWM12) R19.1
TEC_3_HOT: PWM_DRIVER1.20(PWM13) R21.1
TEC_4_COLD: PWM_DRIVER1.17(PWM10) R15.1
TEC_4_HOT: PWM_DRIVER1.18(PWM11) R17.1
TEC_5_COLD: PWM_DRIVER1.15(PWM8) R31.1
TEC_5_HOT: PWM_DRIVER1.16(PWM9) R33.1
TX0: JP2.RXI MCU.47((TXD0/D1)PE1)
TX1: MCU.28((INT3/TXD1/D21)PD3)
VBATT: C2.1 C37.1 C38.1 C44.1 C45.1 C46.1 C118.1 C119.1 C120.1 C126.1 C127.1 D8.K D13.K D14.K LED3.A SW1.S1 VREG1.3(VIN) VREG1.4(VIN) VREG6.1(VI) VREG7.1(!SHDN) VREG7.2(VIN)
VCC: AVR_ISP.2 C8.1 C12.1 C16.1 C20.1 C25.1 C98.1 C99.1 C106.1 C107.1 C108.1 C109.1 C111.1 C116.1 C123.1 C124.1 D8.A D11.K HBRIDGE1.7(NSLEEP) HBRIDGE1.8(VCC) HBRIDGE2.7(NSLEEP) HBRIDGE2.8(VCC) HBRIDGE3.7(NSLEEP) HBRIDGE3.8(VCC) HBRIDGE4.7(NSLEEP) HBRIDGE4.8(VCC) HBRIDGE5.7(NSLEEP) HBRIDGE5.8(VCC) JP2.VCC L3.1 MCU.23(DEVDD) MCU.34(DEVDD) MCU.44(DEVDD) MCU.54(DEVDD) PWM_DRIVER1.28(VCC) R40.2 R41.2 R46.2 VREG1.5(VOUT) VREG1.6(VOUT)
VIBE_1: PWM_DRIVER1.6(PWM0) R6.1
VIBE_2: PWM_DRIVER1.7(PWM1) R7.1
VIBE_3: PWM_DRIVER1.8(PWM2) R8.1
VIBE_4: PWM_DRIVER1.9(PWM3) R9.1
VIBE_5: PWM_DRIVER1.10(PWM4) R10.1
VIBE_6: PWM_DRIVER1.11(PWM5) R13.1
Unconnected: JP2.CTS MCU.13(RSTON) SW1.S2 VREG1.7(FB/NC) VREG1.8(PG)

## Notes on the sheet
- TRANSMISSION OF TOUCH VR
- ROBOTIC ARM
- Rev 1
- ACTUATORS | ATMEGA128RFA1 | SENSORS
- PWM DRIVER | ANALOG DEMUX
- add diode CD1206-S01575
- deleted reset SW
- D10 --> S3 of DEMUX
- NC
- was PE2 | D2
- was PE6 | D6
- was PE7 | D7
- was SSN | D10
- TRY to change these pins?
- test
- test
- I2C ADDR: x40
- D2 --> S0 of DEMUX
- FLEX SENSORS
- PELTIER DRIVERS | VIBROTACTILE DRIVERS
- D6 --> S1 of DEMUX
- D7 --> S2 of DEMUX
- Might add op amps
- 47K? | 47K?
- A0/0 --> SIG_PIN of DEMUX
- 47K? | 47K?
- POWER SYSTEM
- MCU
- TODO: LOTS OF VIAS
- NC | 47K? | 47K?
- NC | NC
- LPF
- VIBROTACTILES
- 47K? | 47K?
- 47K? | 47K?
- THERMOELECTRICS
- PROGRAMMER
- FTDI | AVR ISP
- NC
- CHECK THESE FOR ACCURACY

## Library data of the parts
A6 = PiB_radio_frequency:ANTENNA: Chip antenna Single endded antenna. Common with smaller chip antennas. CHIP4 package is the GPS Chip Antenna SKU: GPS-08418. CHIP5 package is 2.4GHz chip antenna SKU: WRL-00144.; CREATOR: Kenmei; DATASHEET: http://www.linxtechnologies.com/resources/data-guides/ant-xxx-chp-x.pdf; DIST: Digikey; DISTLINK: https://www.digikey.com/products/en?keywords=ANT-2.45-CHPCT-ND; DISTPN: ANT-2.45-CHPCT-ND; MFR: Linx Technologies Inc.; MPN: ANT-2.45-CHP-T
ANALOG_BR NOISE_BR = PiB_power_symbols:2PT_GND_TIE
AVR_ISP = PiB_connectors:AVR_SPI_PRG_6: AVR ISP 6 Pin This is the reduced ISP connector for AVR programming. Common on Arduino. This footprint will take up less PCB space and can be used with a 10-pin to 6-pin adapter such as SKU: BOB-08508; DATASHEET: http://portal.fciconnect.com/Comergent//fci/drawing/67996.pdf; DIST: Digikey; DISTLINK: https://www.digikey.com/products/en?keywords=609-3234-ND; DISTPN: 609-3234-ND; MFR: Amphenol FCI; MPN: 67997-206HLF
B2 = PiB_radio_frequency:BALUN: 0805 footprint balun- Ember 351/357; CREATOR: Kenmei; DATASHEET: http://katalog.we-online.de/pbs/datasheet/748421245.pdf; DIST: Digikey; DISTLINK: https://www.digikey.com/products/en?keywords=732-2230-6-ND; DISTPN: 732-2230-6-ND; MFR: Wurth Electronics Inc; MPN: 748421245
BATT2 = PiB:BATTERY: Generic Dual SMD Pad for Bettery Soldering
C1 C3-C9 C12 C13 C16 C17 C20 C21 C25 C26 C30-C34 C36 C38 C40 C45 C47-C51 C98 C100 C106 C108 C116 C117 C119 C122 C124 C127 C135 = PiB_capacitors:0.1UF; CREATOR: MrSwirlyEyes; DIST: Digikey; DISTLINK: https://www.digikey.com/products/en?keywords=490-11917-1-ND; DISTPN: 490-11917-1-ND; MFR: Murata Electronics North America; MPN: GRM155R61H104KE19D
C2 C42 C46 C118 = PiB_capacitors:100UF; CREATOR: MrSwirlyEyes; DATASHEET: http://www.yuden.co.jp/productdata/catalog/en/mlcc01_e.pdf; DIST: Digikey; DISTLINK: https://www.digikey.com/products/en?keywords=587-3152-1-ND; DISTPN: 587-3152-1-ND; MFR: Taiyo Yuden; MPN: EMK325ABJ107MM-T
C10 C14 C18 C22 C27 C37 C39 C43 C44 C97 C99 C120 C123 C126 = PiB_capacitors:10UF; CREATOR: MrSwirlyEyes; DATASHEET: http://www.samsungsem.com/kr/support/product-search/mlcc/__icsFiles/afieldfile/2017/07/28/S_CL05A106MP5NUNC.pdf; DIST: Digikey; DISTLINK: https://www.digikey.com/products/en?keywords=1276-1450-1-ND; DISTPN: 1276-1450-1-ND; MFR: Samsung Electro-Mechanics; MPN: CL05A106MP5NUNC
C41 = PiB_capacitors:47UF; CREATOR: MrSwirlyEyes; DATASHEET: http://search.murata.co.jp/Ceramy/image/img/A01X/G101/ENG/GRM21BR61A476ME15-01.pdf; DIST: Digikey; DISTLINK: https://www.digikey.com/products/en?keywords=490-9961-1-ND; DISTPN: 490-9961-1-ND; MFR: Murata Electronics North America; MPN: GRM21BR61A476ME15L
C107 C109-C111 C132 C134 C136 = PiB_capacitors:1UF; CREATOR: MrSwirlyEyes; DATASHEET: http://search.murata.co.jp/Ceramy/image/img/A01X/G101/ENG/GRM155C81E105KE11-01.pdf; DIST: Digikey; DISTLINK: https://www.digikey.com/products/en?keywords=490-10014-1-ND; DISTPN: 490-10014-1-ND; MFR: Murata Electronics North America; MPN: GRM155C81E105KE11D
C112 C113 = PiB_capacitors:12PF; CREATOR: MrSwirlyEyes; DATASHEET: http://search.murata.co.jp/Ceramy/image/img/A01X/G101/ENG/GRM1555C2A120JA01-01.pdf; DIST: Digikey; DISTLINK: https://www.digikey.com/products/en?keywords=490-7300-1-ND; DISTPN: 490-7300-1-ND; MFR: Murata Electronics North America; MPN: GRM1555C2A120JA01D
C114 = PiB_capacitors:22PF; CREATOR: MrSwirlyEyes; DATASHEET: http://search.murata.co.jp/Ceramy/image/img/A01X/G101/ENG/GRM1555C1H220JA01-01.pdf; DIST: Digikey; DISTLINK: https://www.digikey.com/products/en?keywords=490-5868-1-ND; DISTPN: 490-5868-1-ND; MFR: Murata Electronics North America; MPN: GRM1555C1H220JA01D
C115 = PiB_capacitors:0.75PF; CREATOR: MrSwirlyEyes; DATASHEET: https://www.murata.com/~/media/webrenewal/support/library/catalog/products/capacitor/mlcc/c02e.ashx?la=en-us; DIST: Digikey; DISTLINK: https://www.digikey.com/products/en?keywords=490-5960-1-ND; DISTPN: 490-5960-1-ND; MFR: Murata Electronics North America; MPN: GRM1555C1HR75CA01D
D1-D5 D11 D12 = PiB_discrete_semiconductors:DIODE_GENERAL-PURPOSE; CREATOR: MrSwirlyEyes; DATASHEET: http://www.comchiptech.com/cms/UserFiles/CDSQR4148-HF-RevC213424.pdf; DIST: Digikey; DISTLINK: https://www.digikey.com/products/en?keywords=641-1677-1-ND; DISTPN: 641-1677-1-ND; MFR: Comchip Technology; MPN: CDSQR4148-HF
D8 D13 D14 = PiB_discrete_semiconductors:DIODE_GENERAL-PURPOSE; CREATOR: MrSwirlyEyes; DATASHEET: http://www.comchiptech.com/cms/UserFiles/CGRKM4001-HF%20Thru.%20CGRKM4007-HF%20RevG.pdf; DIST: Digikey; DISTLINK: https://www.digikey.com/products/en?keywords=641-1511-1-ND; DISTPN: 641-1511-1-ND; MFR: Comchip Technology; MPN: CGRKM4001-HF; TESTED: NO
DEMUX1 = PiB:CD74HC4067-SM96_16:1_MUX-DEMUX; CREATOR: MrSwirlyEyes; DATASHEET: http://www.ti.com/lit/ds/symlink/cd74hc4067.pdf; DIST: Digikey; DISTLINK: https://www.digikey.com/products/en?keywords=296-9226-1-ND; DISTPN: 296-9226-1-ND; MFR: Texas Instruments; MPN: CD74HC4067SM96; TESTED: NO
FLEX1-FLEX10 = PiB:FLEX-SENSOR; CREATOR: MrSwirlyEyes; DATASHEET: https://cdn.sparkfun.com/datasheets/Sensors/ForceFlex/FLEX%20SENSOR%20DATA%20SHEET%202014.pdf; DIST: Sparkfun; DISTLINK: https://www.sparkfun.com/products/10264; DISTPN: SEN-10264; MFR: Spectra Symbol; MPN: FS-L-0055-103-ST?
HBRIDGE1-HBRIDGE5 = PiB:DRV883X_H-BRIDGE_: DRV883x Series H-Bridge - DRV8837 -> PWM (IN1 & IN2); DRV8838 -> PH IN1/ENA IN2; CREATOR: MrSwirlyEyes; DATASHEET: http://www.ti.com/lit/ds/symlink/drv8837c.pdf; DIST: Digikey; DISTLINK: https://www.digikey.com/products/en?keywords=296-44747-1-ND; DISTPN: 296-44747-1-ND; MFR: Texas Instruments; MPN: DRV8837CDSGT; TESTED: NO
JP2 = PiB_connectors:FTDI: FTDI Basic header with labels; DATASHEET: http://portal.fciconnect.com/Comergent//fci/drawing/68015.pdf; DIST: Digikey; DISTLINK: https://www.digikey.com/products/en?keywords=609-3327-ND; DISTPN: 609-3327-ND; MFR: Amphenol FCI; MPN: 68016-406HLF; PRICE: 0.33
L3 L4 = PiB_inductors:10UH; CREATOR: MrSwirlyEyes; DATASHEET: http://ds.yuden.co.jp/TYCOMPAS/ut/detail.do?productNo=CBMF1608T100K&fileName=CBMF1608T100K_SS&mode=specSheetDownload; DIST: Digikey; DISTLINK: https://www.digikey.com/products/en?keywords=587-1720-1-ND; DISTPN: 587-1720-1-ND; MFR: Taiyo Yuden; MPN: CBMF1608T100K
LED1 = PiB_leds:LED; CREATOR: MrSwirlyEyes; DATASHEET: https://www.bivar.com/portals/0/products/SM0402GC.pdf; DIST: Digikey; DISTLINK: https://www.digikey.com/products/en?keywords=492-2205-1-ND; DISTPN: 492-2205-1-ND; MFR: Bivar Inc.; MPN: SM0402GC
LED2 = PiB_leds:LED; CREATOR: MrSwirlyEyes; DATASHEET: https://www.bivar.com/portals/0/products/SM0402RC.pdf; DIST: Digikey; DISTLINK: https://www.digikey.com/products/en?keywords=492-2208-1-ND; DISTPN: 492-2208-1-ND; MFR: Bivar Inc.; MPN: SM0402RC
LED3 = PiB_leds:LED; CREATOR: MrSwirlyEyes; DATASHEET: https://www.bivar.com/portals/0/products/SM0402BWC.pdf; DIST: Digikey; DISTLINK: https://www.digikey.com/products/en?keywords=492-2203-1-ND; DISTPN: 492-2203-1-ND; MFR: Bivar Inc.; MPN: SM0402BWC
MCU = PiB_ic_microcontrollers:ATMEGA128RFA1: ATmega128RFA1 8-bit AVR Microcontroller with Low Power 2.4GHz Transceiver for ZigBee and IEEE 802.15.4; CREATOR: Kenmei; DATASHEET: http://www.atmel.com/Images/Atmel-8266-MCU_Wireless-ATmega128RFA1_Datasheet.pdf; DIST: Digikey; DISTLINK: https://www.digikey.com/products/en?mpart=ATMEGA128RFA1-ZU; DISTPN: ATMEGA128RFA1-ZU-ND; MFR: Atmel; MPN: ATMEGA128RFA1-ZU; TESTED: YES
PWM_DRIVER1 = PiB:PCA9685_16-CH_12-BIT_PWM-DRIVER; CREATOR: MrSwirlyEyes; DATASHEET: http://www.nxp.com/docs/en/data-sheet/PCA9685.pdf; DIST: Digikey; DISTLINK: https://www.digikey.com/products/en?keywords=568-11925-1-ND; DISTPN: 568-11925-1-ND; MFR: NXP USA Inc.; MPN: PCA9685PW,118
Q1-Q6 = PiB_discrete_semiconductors:POWER_NCHAN: Collection of Power MOSFET; CREATOR: Kenmei; DATASHEET: https://media.digikey.com/pdf/Data%20Sheets/ON%20Semiconductor%20PDFs/MCH3474.pdf; DIST: Digikey; DISTLINK: https://www.digikey.com/products/en?keywords=MCH3474-TL-WOSCT; DISTPN: MCH3474-TL-WOSCT-ND; MFR: ON Semiconductor; MPN: MCH3474-TL-W; TESTED: No
R1-R5 R12 R14 R16 R18 R20 R22 R24 R26 R28 R30 R32 R46 R47 = PiB_resistors:10KΩ; CREATOR: MrSwirlyEyes; DATASHEET: http://www.yageo.com/documents/recent/PYu-RC_Group_51_RoHS_L_8.pdf; DIST: Digikey; DISTLINK: https://www.digikey.com/products/en?keywords=311-10KJRCT-ND; DISTPN: 311-10KJRCT-ND; MFR: Yageo; MPN: RC0402JR-0710KL
R6-R10 R13 R15 R17 R19 R21 R23 R25 R27 R29 R31 R33 = PiB_resistors:100Ω; CREATOR: MrSwirlyEyes; DATASHEET: http://www.yageo.com/documents/recent/PYu-RC_Group_51_RoHS_L_8.pdf; DIST: Digikey; DISTLINK: https://www.digikey.com/products/en?keywords=311-100JRCT-ND; DISTPN: 311-100JRCT-ND; MFR: Yageo; MPN: RC0402JR-07100RL
R11 R34-R39 R42-R44 = PiB_resistors:47KΩ; CREATOR: MrSwirlyEyes; DATASHEET: http://www.yageo.com/documents/recent/PYu-RC_Group_51_RoHS_L_8.pdf; DIST: Digikey; DISTLINK: https://www.digikey.com/products/en?keywords=311-47KJRCT-ND; DISTPN: 311-47KJRCT-ND; MFR: Yageo; MPN: RC0402JR-0747KL
R40 R41 = PiB_resistors:4.7KΩ; CREATOR: MrSwirlyEyes; DATASHEET: http://www.yageo.com/documents/recent/PYu-RC_Group_51_RoHS_L_8.pdf; DIST: Digikey; DISTLINK: https://www.digikey.com/products/en?keywords=311-4.7KJRCT-ND; DISTPN: 311-4.7KJRCT-ND; MFR: Yageo; MPN: RC0402JR-074K7L
R48 = PiB_resistors:2KΩ; CREATOR: MrSwirlyEyes; DATASHEET: http://www.yageo.com/documents/recent/PYu-RC_Group_51_RoHS_L_8.pdf; DIST: Digikey; DISTLINK: https://www.digikey.com/products/en?keywords=311-2.0KJRCT-ND; DISTPN: 311-2.0KJRCT-ND; MFR: Yageo; MPN: RC0402JR-072KL
R49 = PiB_resistors:1KΩ; CREATOR: MrSwirlyEyes; DATASHEET: http://www.yageo.com/documents/recent/PYu-RC_Group_51_RoHS_L_8.pdf; DIST: Digikey; DISTLINK: https://www.digikey.com/products/en?keywords=311-1.0KJRCT-ND; DISTPN: 311-1.0KJRCT-ND; MFR: Yageo; MPN: RC0402JR-071KL
SW1 = PiB_switches:SWITCH_SPDT; CREATOR: MrSwirlyEyes; DATASHEET: http://spec_sheets.e-switch.com/specs/T511006.pdf; DIST: Digikey; DISTLINK: https://www.digikey.com/products/en?keywords=EG2478-ND; DISTPN: EG2478-ND; MFR: E-Switch; MPN: 500SSP1S1M6QEA
TEC1-TEC5 = PiB:PELTIER-TEC; CREATOR: MrSwirlyEyes; DATASHEET: http://www.marlow.com/downloads/dl/file/id/212/product/25/nl1025t.pdf; DIST: Digikey; DISTLINK: https://www.digikey.com/products/en?keywords=1681-1032-ND; DISTPN: 1681-1032-ND; MFR: Marlow Industries, Inc.; MPN: NL1025T-01AC; TESTED: NO
VIBE1-VIBE6 = PiB:VIBE_MOTOR_100MA/3V; CREATOR: MrSwirlyEyes; DATASHEET: http://www.vibration-motor.com/products/download/C0825B002F.pdf; DIST: Digikey; DISTLINK: https://www.digikey.com/products/en?keywords=1670-1002-ND; DISTPN: 1670-1002-ND; MFR: Jinlong Machinery & Electronics, Inc.; MPN: C0825B002F; TESTED: NO
VREG1 = PiB_ic_power:VREG_TPS76833_ULDO_FAST-TRANSIENT_1A-3.3V; CREATOR: MrSwirlyEyes; DATASHEET: http://www.ti.com/lit/ds/symlink/tps768.pdf; DIST: Digikey; DISTLINK: https://www.digikey.com/products/en?keywords=296-46395-1-ND; DISTPN: 296-46395-1-ND; MFR: Texas Instruments; MPN: TPS76833QDR
VREG6 = PiB_ic_power:VREG_LINEAR_FIXED; CREATOR: MrSwirlyEyes; DATASHEET: http://www.ti.com/lit/ds/symlink/tl1963a.pdf; DIST: Digikey; DISTLINK: https://www.digikey.com/products/en?keywords=296-24897-1-ND; DISTPN: 296-24897-1-ND; MFR: Texas Instruments; MPN: TL1963A-33DCYR
VREG7 = PiB_ic_power:VREG_LT1764EQ_ULDO_FAST-TRANSIENT; CREATOR: MrSwirlyEyes; DATASHEET: http://cds.linear.com/docs/en/datasheet/1764fb.pdf; DIST: Digikey; DISTLINK: https://www.digikey.com/products/en?keywords=LT1764EQ-1.8%23PBF-ND; DISTPN: LT1764EQ-1.8#PBF-ND; MFR: Linear Technology; MPN: LT1764EQ-1.8#PBF
Y2 = PiB:CRYSTAL: Various standard crystals. Proven footprints.; DATASHEET: http://www.abracon.com/Resonators/abm3b.pdf; DIST: Digikey; DISTLINK: https://www.digikey.com/products/en?keywords=535-9122-1-ND; DISTPN: 535-9122-1-ND; MFR: Abracon LLC; MPN: ABM3B-16.000MHZ-B2-T